# Altium schematic sheet Human_Body_Detection.SchDoc
size A4
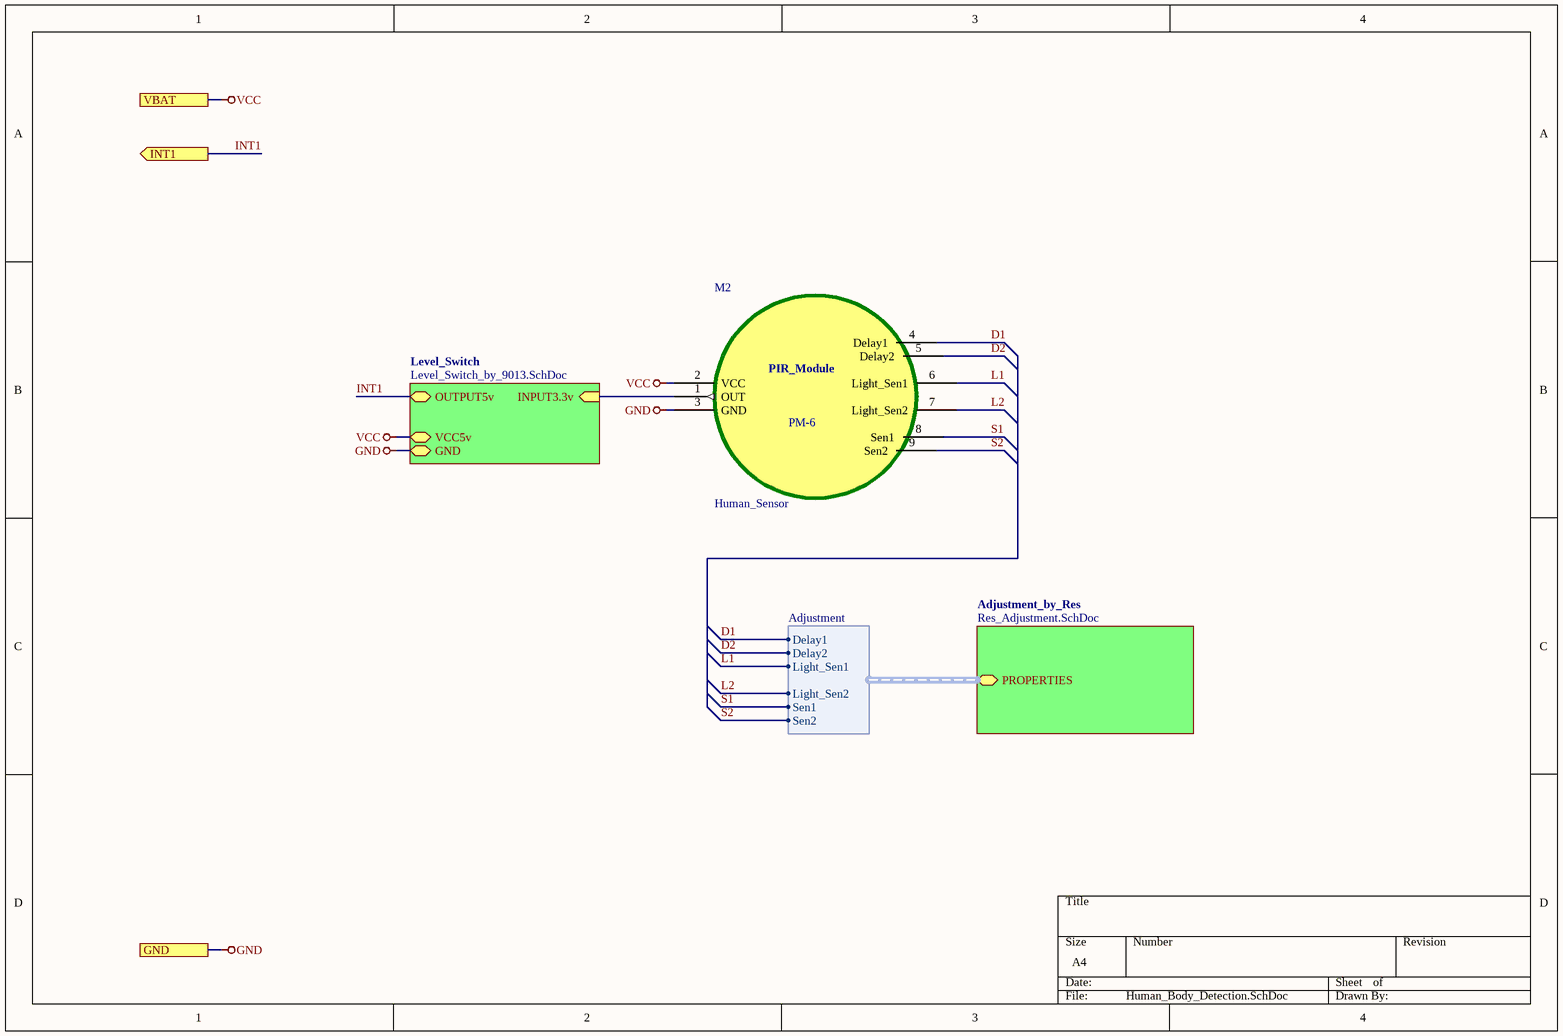
[diagram p0: Human_Body_Detection.SchDoc]

## Parts
M2  Human_Sensor  [PM-6]

## Sub-sheets
Adjustment_by_Res = Res_Adjustment.SchDoc: PROPERTIES (harness Adjustment)
Level_Switch = Level_Switch_by_9013.SchDoc: VCC5v, GND, OUTPUT5v, INPUT3.3v (in)

## Ports
GND, INT1 (out), VBAT

## Harnesses
Adjustment: Delay1, Delay2, Light_Sen1, Light_Sen2, Sen1, Sen2

## Nets
GND: M2.3(GND) ; port GND, sheet Level_Switch/GND
VCC: M2.2(VCC) ; port VBAT, sheet Level_Switch/VCC5v
D1: M2.4(Delay1) ; sheet Adjustment_by_Res/PROPERTIES.Delay1
D2: M2.5(Delay2) ; sheet Adjustment_by_Res/PROPERTIES.Delay2
INT1: port INT1, sheet Level_Switch/OUTPUT5v
L1: M2.6(Light_Sen1) ; sheet Adjustment_by_Res/PROPERTIES.Light_Sen1
L2: M2.7(Light_Sen2) ; sheet Adjustment_by_Res/PROPERTIES.Light_Sen2
S1: M2.8(Sen1) ; sheet Adjustment_by_Res/PROPERTIES.Sen1
S2: M2.9(Sen2) ; sheet Adjustment_by_Res/PROPERTIES.Sen2
NetM2_1: M2.1(OUT) ; sheet Level_Switch/INPUT3.3v

## Notes on the sheet
- (in symbol Human_Sensor) PIR_Module; PM-6